# Altium schematic sheet amplificadorAudio.SchDoc: CONTROLADORA MAIS PIPOCA - REVISÃO EMC
size A3; DocumentNumber: GA0078; SheetNumber: 4; SheetTotal: 17
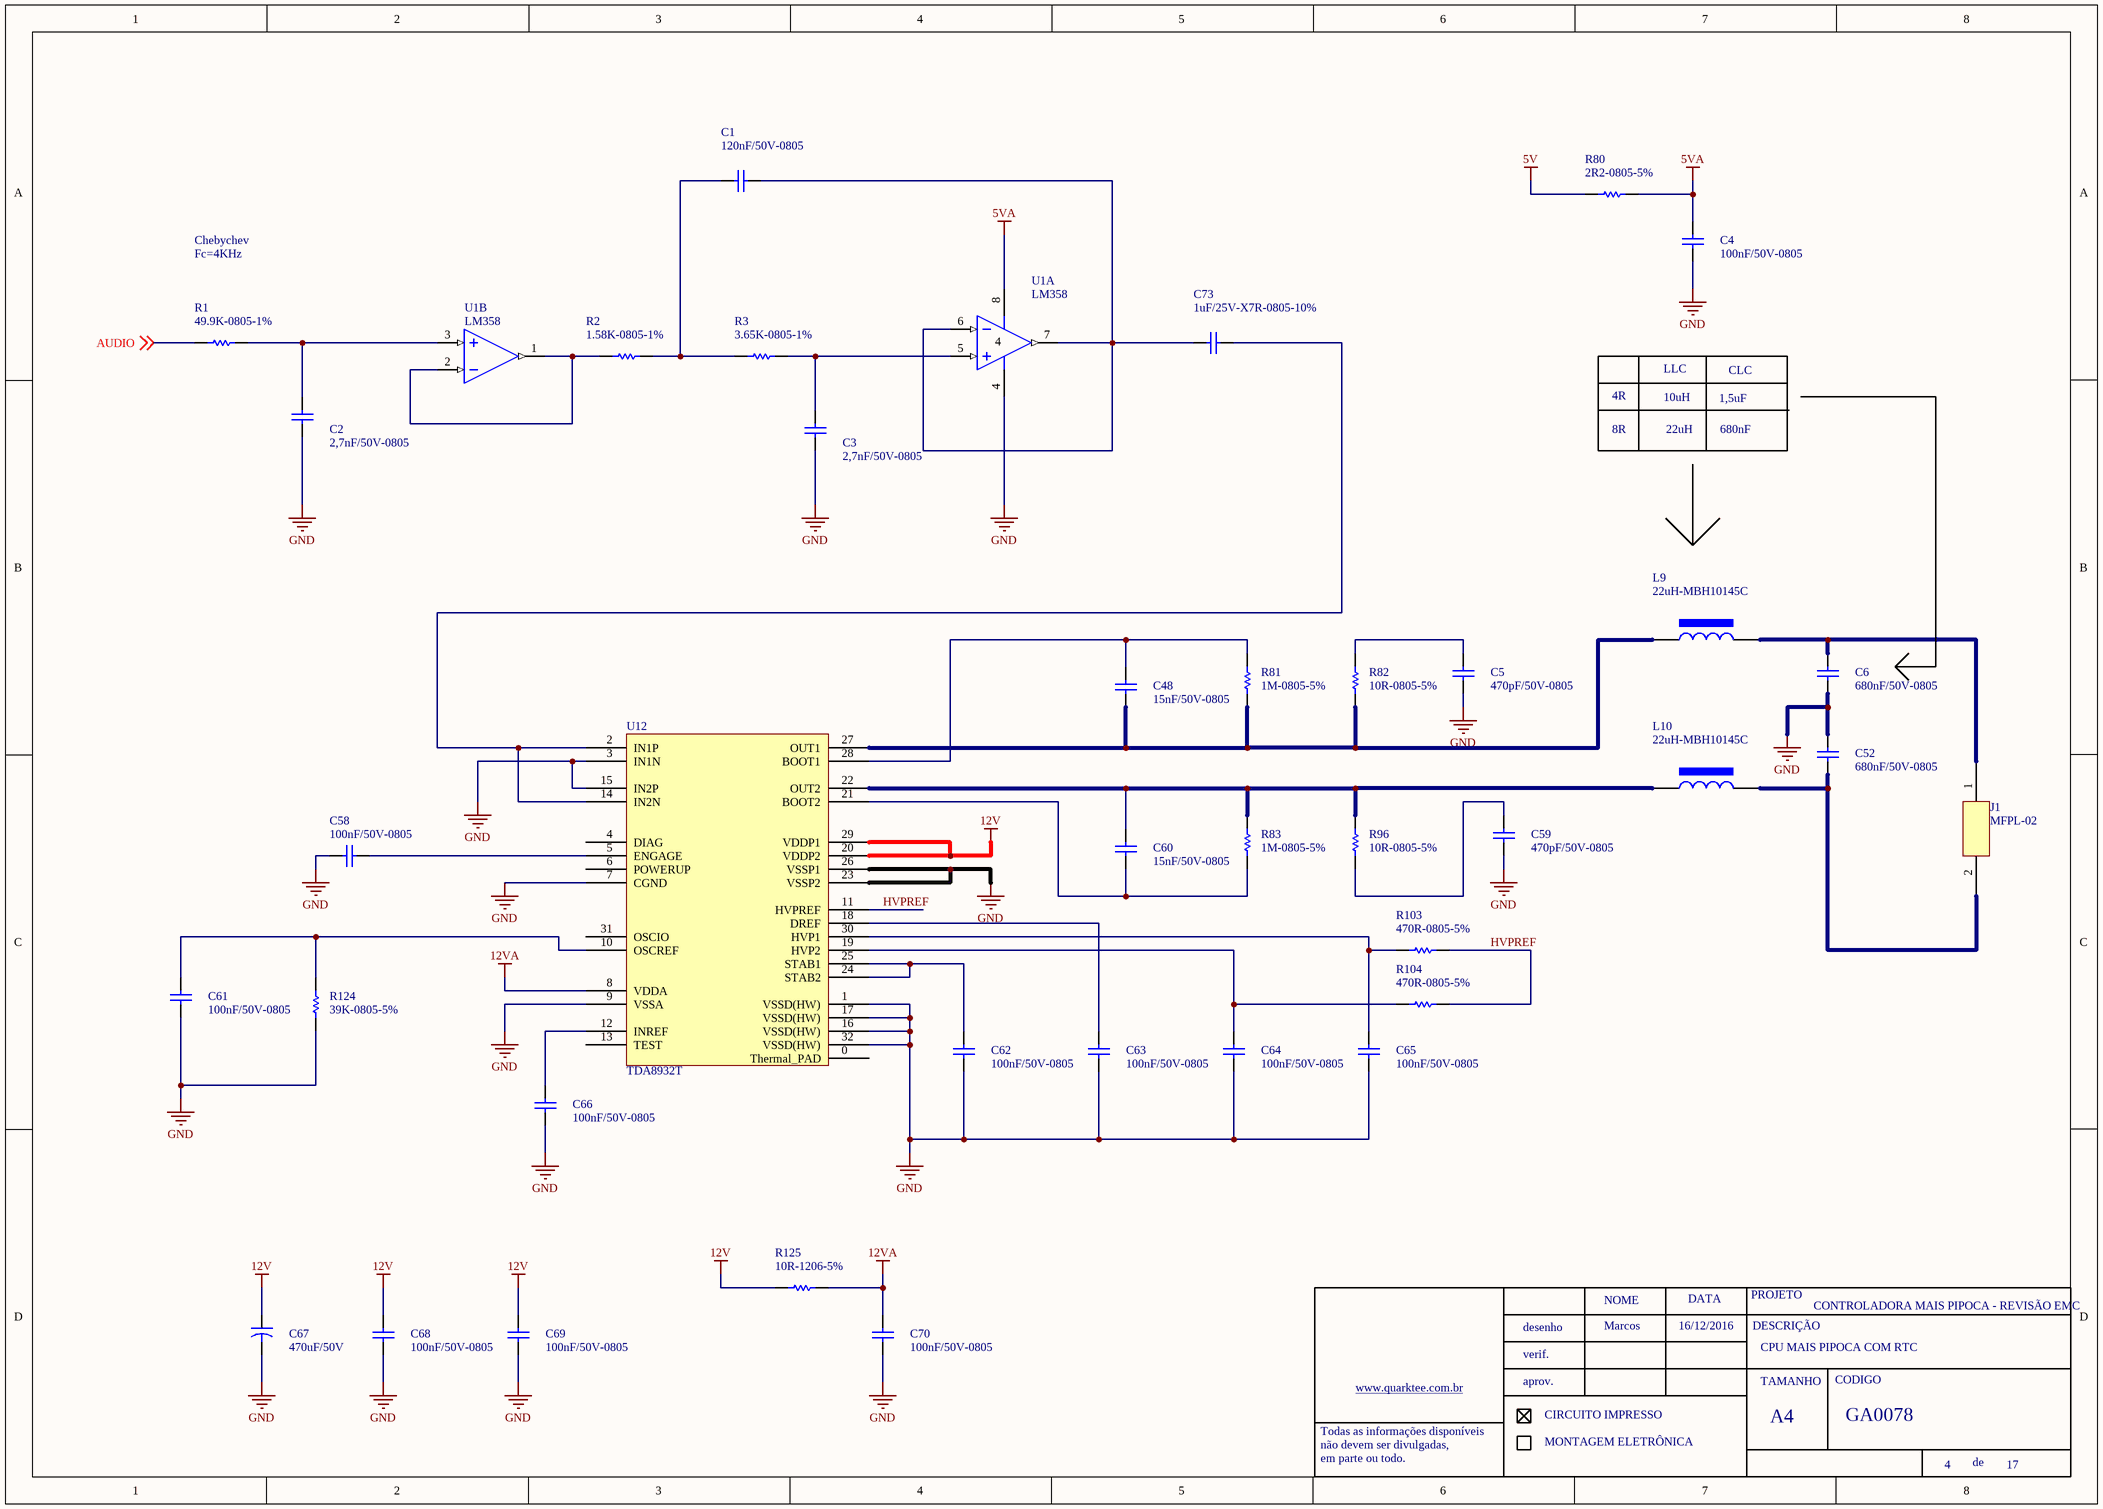
[diagram p0: amplificadorAudio.SchDoc]

## Parts
C1  120nF/50V-0805  [0805-REVISADO ONDA]
C2  2,7nF/50V-0805  [0805-REVISADO ONDA]
C3  2,7nF/50V-0805  [0805-REVISADO ONDA]
C4  100nF/50V-0805  [0805-REVISADO ONDA]
C5  470pF/50V-0805  [0805-REVISADO ONDA]
C6  680nF/50V-0805  [0805-REVISADO ONDA]
C48  15nF/50V-0805  [0805-REVISADO ONDA]
C52  680nF/50V-0805  [0805-REVISADO ONDA]
C58  100nF/50V-0805  [0805-REVISADO ONDA]
C59  470pF/50V-0805  [0805-REVISADO ONDA]
C60  15nF/50V-0805  [0805-REVISADO ONDA]
C61  100nF/50V-0805  [0805-REVISADO ONDA]
C62  100nF/50V-0805  [0805-REVISADO ONDA]
C63  100nF/50V-0805  [0805-REVISADO ONDA]
C64  100nF/50V-0805  [0805-REVISADO ONDA]
C65  100nF/50V-0805  [0805-REVISADO ONDA]
C66  100nF/50V-0805  [0805-REVISADO ONDA]
C67  470uF/50V
C68  100nF/50V-0805  [0805-REVISADO ONDA]
C69  100nF/50V-0805  [0805-REVISADO ONDA]
C70  100nF/50V-0805  [0805-REVISADO ONDA]
C73  1uF/25V-X7R-0805-10%  [0805-REVISADO ONDA]
J1  MFPL-02  [MFPL-02]
L9  22uH-MBH10145C
L10  22uH-MBH10145C
R1  49.9K-0805-1%  [0805-REVISADO ONDA]
R2  1.58K-0805-1%  [0805-REVISADO ONDA]
R3  3.65K-0805-1%  [0805-REVISADO ONDA]
R80  2R2-0805-5%
R81  1M-0805-5%  [0805-REVISADO ONDA]
R82  10R-0805-5%  [0805-REVISADO ONDA]
R83  1M-0805-5%  [0805-REVISADO ONDA]
R96  10R-0805-5%  [0805-REVISADO ONDA]
R103  470R-0805-5%  [0805-REVISADO ONDA]
R104  470R-0805-5%  [0805-REVISADO ONDA]
R124  39K-0805-5%  [0805-REVISADO ONDA]
R125  10R-1206-5%
U1  LM358  (parts A,B of 2)
U12  TDA8932T

## Nets
5V: R80.1
5VA: C4.2 R80.2 U1.8(V+)
12V: C67.1 C68.2 C69.2 R125.1 U12.20(VDDP2) U12.29(VDDP1)
12VA: C70.2 R125.2 U12.8(VDDA)
GND: C2.1 C3.1 C4.1 C5.1 C6.1 C52.2 C58.2 C59.1 C61.1 C62.1 C63.1 C64.1 C65.1 C66.1 C67.2 C68.1 C69.1 C70.1 R124.1 U1.4(GND) U12.1(VSSD(HW)) U12.3(IN1N) U12.7(CGND) U12.9(VSSA) U12.15(IN2P) U12.16(VSSD(HW)) U12.17(VSSD(HW)) U12.23(VSSP2) U12.26(VSSP1) U12.32(VSSD(HW))
AUDIO: R1.1 ; off-sheet AUDIO
HVPREF: R103.1 R104.1 U12.11(HVPREF)
NetC1_1: C1.1 C73.2 U1.6(IN-) U1.7(OUT)
NetC1_2: C1.2 R2.2 R3.1
NetC2_2: C2.2 R1.2 U1.3(IN+)
NetC3_2: C3.2 R3.2 U1.5(IN+)
NetC5_2: C5.2 R82.1
NetC6_2: C6.2 J1.1 L9.1
NetC48_1: C48.1 L9.2 R81.2 R82.2 U12.27(OUT1)
NetC48_2: C48.2 R81.1 U12.28(BOOT1)
NetC52_1: C52.1 J1.2 L10.1
NetC58_1: C58.1 U12.5(ENGAGE)
NetC59_2: C59.2 R96.2
NetC60_1: C60.1 R83.2 U12.21(BOOT2)
NetC60_2: C60.2 L10.2 R83.1 R96.1 U12.22(OUT2)
NetC61_2: C61.2 R124.2 U12.10(OSCREF)
NetC62_2: C62.2 U12.24(STAB2) U12.25(STAB1)
NetC63_2: C63.2 U12.18(DREF)
NetC64_2: C64.2 R104.2 U12.19(HVP2)
NetC65_2: C65.2 R103.2 U12.30(HVP1)
NetC66_2: C66.2 U12.12(INREF)
NetC73_1: C73.1 U12.2(IN1P) U12.14(IN2N)
NetR2_1: R2.1 U1.1(OUT) U1.2(IN-)

Not connected (* = marked no-connect by the designer): U12 0(Thermal_PAD) 4(DIAG) 6(POWERUP) 13(TEST) 31(OSCIO)

## Notes on the sheet
- Chebychev
- Fc=4KHz
- LLC
- CLC
- 4R
- 8R
- 10uH
- 22uH
- 1,5uF
- 680nF
- Marcos
- 16/12/2016
- CPU MAIS PIPOCA COM RTC
- NOME
- DATA
- PROJETO
- DESCRIÇÃO
- www.quarktee.com.br
- desenho
- verif.
- aprov.
- TAMANHO
- CODIGO
- Todas as informações disponíveis
- não devem ser divulgadas,
- em parte ou todo.
- CIRCUITO IMPRESSO
- MONTAGEM ELETRÔNICA
- A4
- de

## Library data of the parts
C1-C3 C5 C6 C48 C52 C59 C60 C73 = 100nF/50-0805-NPO: 100nF/50V-0805; ERP: 104.11.005
C4 C58 C61-C66 C68-C70 = 100nF/50-0805-NPO: ERP: 104.11.005
L9 L10 = indutor 1mH CNF15: 1mH-CNF15-26 AWG; ERP: 211.00.012
R1-R3 R81-R83 R96 R103 R104 R124 = 10K-0805-5%: ERP: 102.11.054
R80 R125 = 10R-0805-5%: ERP: 102.11.019
U1 = LM358: ERP: 10802003
C67 = 470uF/50V: ERP: 105.01.005